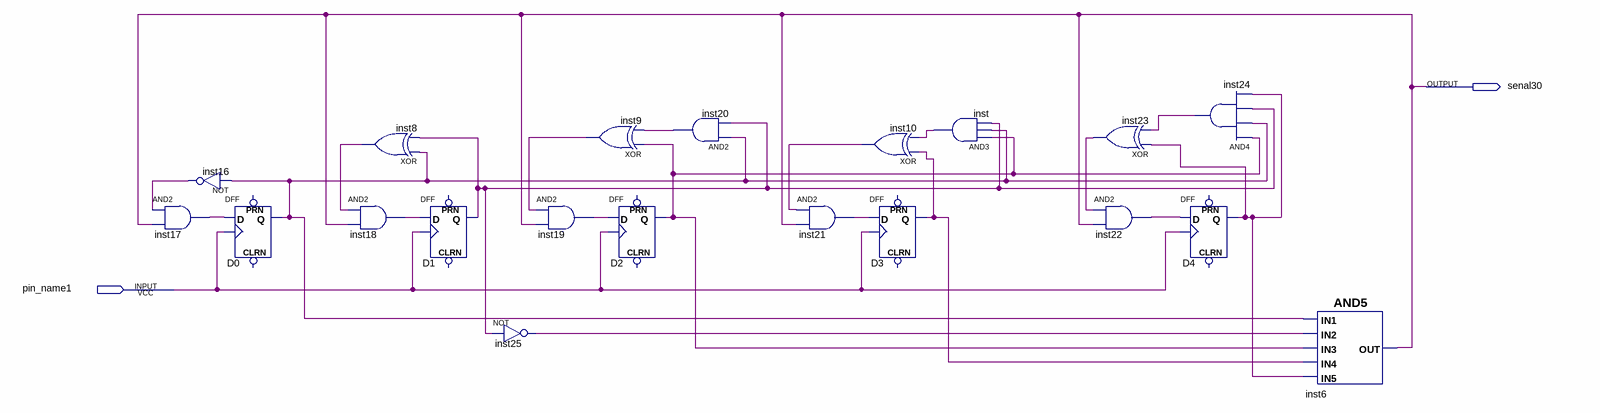
[diagram p0: schematic sheet]
// Quartus schematic contador.bdf as structural Verilog: 20 symbols, 2 pins
module contador (
  input  pin_name1,
  output senal30
);

  wire D0_q, D1_q, D2_q, D3_q, D4_q, inst8_out, inst9_out, inst10_out, inst16_out, inst17_out, inst18_out,
       inst19_out, inst20_out, inst21_out, inst22_out, inst23_out, inst24_out, inst25_out, inst_out;

  not inst16 (inst16_out, D0_q);
  and inst17 (inst17_out, inst16_out, senal30);
  DFF D0 (.CLK(pin_name1), .D(inst17_out), .Q(D0_q));  // open: CLRN, PRN
  xor inst8 (inst8_out, D0_q, D1_q);
  and inst18 (inst18_out, inst8_out, senal30);
  DFF D1 (.CLK(pin_name1), .D(inst18_out), .Q(D1_q));  // open: CLRN, PRN
  and inst19 (inst19_out, inst9_out, senal30);
  not inst25 (inst25_out, D1_q);
  xor inst9 (inst9_out, D2_q, inst20_out);
  DFF D2 (.CLK(pin_name1), .D(inst19_out), .Q(D2_q));  // open: CLRN, PRN
  and inst20 (inst20_out, D0_q, D1_q);
  and inst21 (inst21_out, inst10_out, senal30);
  xor inst10 (inst10_out, D3_q, inst_out);
  DFF D3 (.CLK(pin_name1), .D(inst21_out), .Q(D3_q));  // open: CLRN, PRN
  and inst (inst_out, D2_q, D0_q, D1_q);
  xor inst23 (inst23_out, D4_q, inst24_out);
  and inst22 (inst22_out, inst23_out, senal30);
  and inst24 (inst24_out, D2_q, D0_q, D1_q, D4_q);
  DFF D4 (.CLK(pin_name1), .D(inst22_out), .Q(D4_q));  // open: CLRN, PRN
  and inst6 (senal30, D0_q, inst25_out, D2_q, D3_q, D4_q);
endmodule
